# Altium schematic sheet Photodiode_AFE.schdoc: Photodiode & sensor
size 420 x 297 mm; EDA_Number: ARTIQ; Projet: KASLI 3U subsystem; CheckedBy: MK; Author: G.K.; CompanyName: CREOTECH; DrawnBy: G.K.; Organization: CTI SA; Address1: Creotech Instruments SA; Address2: Okulickiego 7/9, 05-500 Poland; DocumentNumber: 3; Revision: -; SheetNumber: 3; SheetTotal: 5; ModifiedBy: -; CreateDate: XX/XX/XXXX; CheckedDate: -; Title2: AFE; DivGrp: CTI; Designer: G.K.; ModifiedDate: -; ProjectName: FMC DAC 100M 14B 16CHA ADC 2M 14B 4CHA
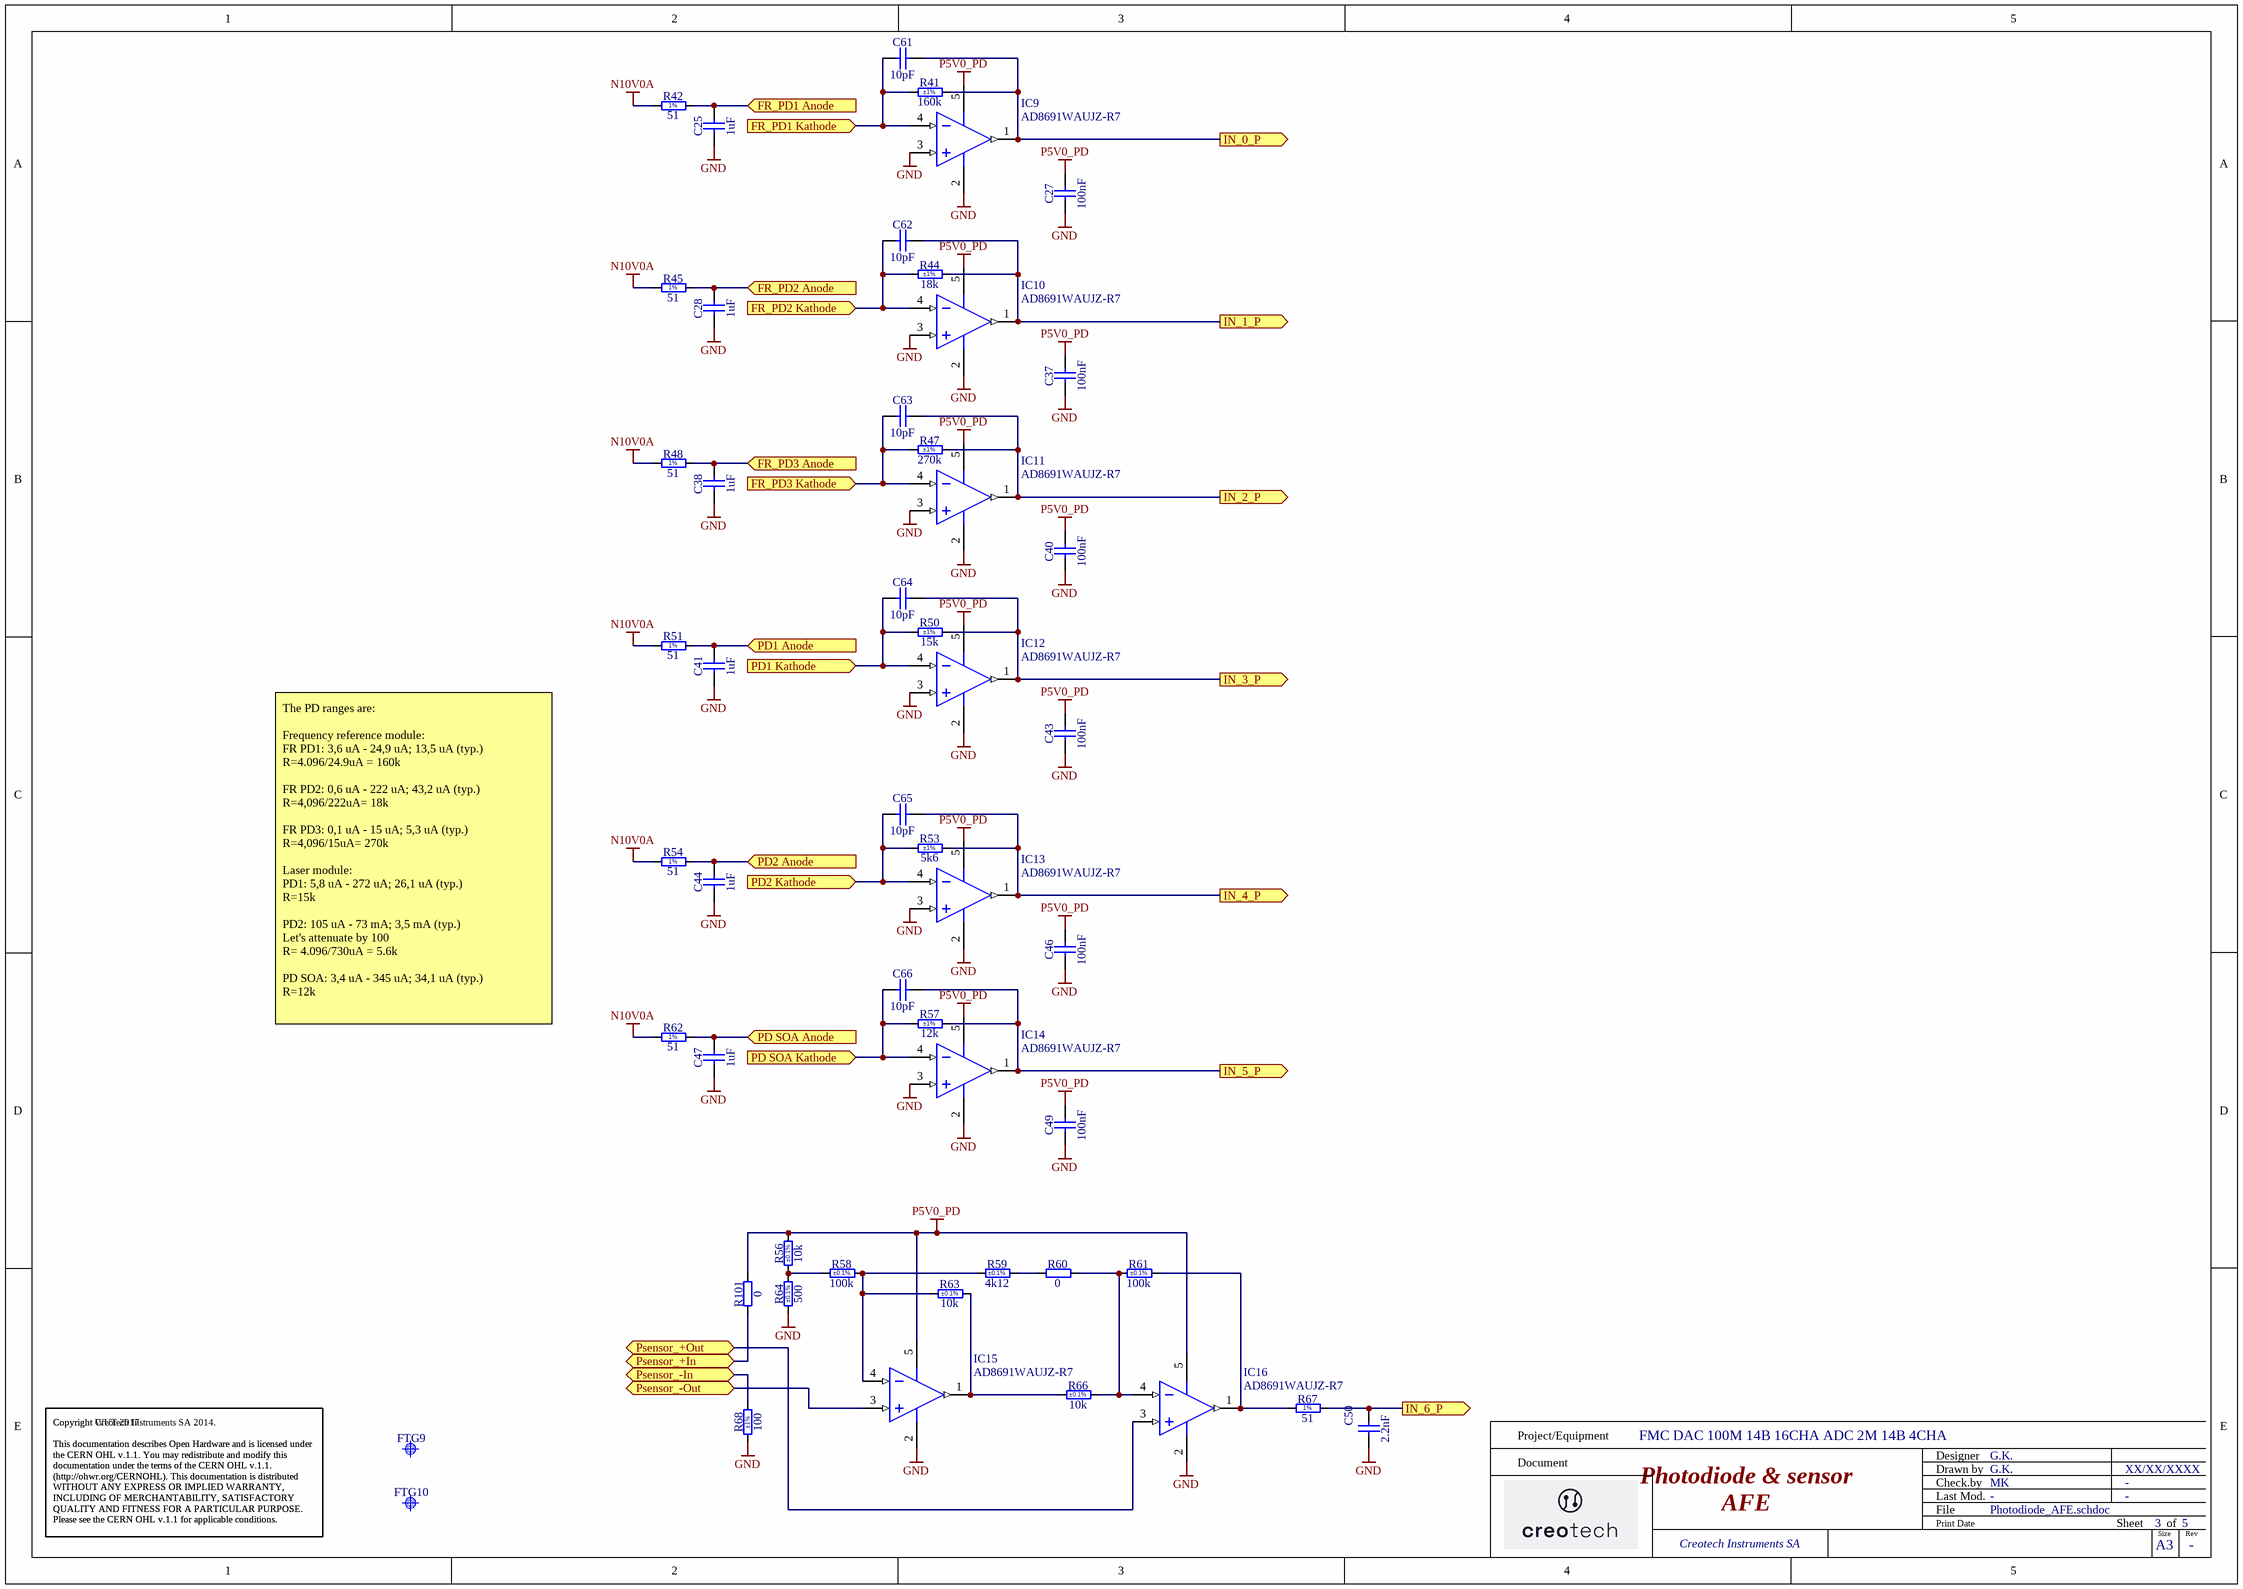
[diagram p0: Photodiode_AFE.schdoc]

## Parts
C25  1uF  [CAPC1005X55N]
C27  100nF  [CAPC1005X55N]
C28  1uF  [CAPC1005X55N]
C37  100nF  [CAPC1005X55N]
C38  1uF  [CAPC1005X55N]
C40  100nF  [CAPC1005X55N]
C41  1uF  [CAPC1005X55N]
C43  100nF  [CAPC1005X55N]
C44  1uF  [CAPC1005X55N]
C46  100nF  [CAPC1005X55N]
C47  1uF  [CAPC1005X55N]
C49  100nF  [CAPC1005X55N]
C50  2.2nF  [CAPC2013X100N]
C61  10pF  [CAPC1005X55N]
C62  10pF  [CAPC1005X55N]
C63  10pF  [CAPC1005X55N]
C64  10pF  [CAPC1005X55N]
C65  10pF  [CAPC1005X55N]
C66  10pF  [CAPC1005X55N]
FTG9  Use only in PCB  [FIDUCIAL_TOP_C100-200]  (value not drawn)
FTG10  Use only in PCB  [FIDUCIAL_TOP_S100-200]  (value not drawn)
IC9  AD8691WAUJZ-R7  [ADI-UJ-5_L]
IC10  AD8691WAUJZ-R7  [ADI-UJ-5_L]
IC11  AD8691WAUJZ-R7  [ADI-UJ-5_L]
IC12  AD8691WAUJZ-R7  [ADI-UJ-5_L]
IC13  AD8691WAUJZ-R7  [ADI-UJ-5_L]
IC14  AD8691WAUJZ-R7  [ADI-UJ-5_L]
IC15  AD8691WAUJZ-R7  [ADI-UJ-5_L]
IC16  AD8691WAUJZ-R7  [ADI-UJ-5_L]
R41  160k  Tolerance: ±1%  [RESC1608X55N]
R42  51  [RESC1005X40N]
R44  18k  Tolerance: ±1%  [RESC1608X55N]
R45  51  [RESC1005X40N]
R47  270k  Tolerance: ±1%  [RESC1608X55N]
R48  51  [RESC1005X40N]
R50  15k  Tolerance: ±1%  [RESC1608X55N]
R51  51  [RESC1005X40N]
R53  5k6  Tolerance: ±1%  [RESC1608X55N]
R54  51  [RESC1005X40N]
R56  10k  Tolerance: ±0.1%  [RESC1608X64N]
R57  12k  Tolerance: ±1%  [RESC1608X55N]
R58  100k  Tolerance: ±0.1%  [RESC1608X55N]
R59  4k12  Tolerance: ±0.1%  [RESC1608X55N]
R60  0  [RESC1608X55N]
R61  100k  Tolerance: ±0.1%  [RESC1608X55N]
R62  51  [RESC1005X40N]
R63  10k  Tolerance: ±0.1%  [RESC1608X64N]
R64  500  Tolerance: ±0.1%  [RESC1106X84N]
R66  10k  Tolerance: ±0.1%  [RESC1608X64N]
R67  51  [RESC1005X40N]
R68  100  Tolerance: ±1%  [RESC1005X40N]
R101  0  [RESC1608X55N]

## Ports
FR_PD1 Anode (in), FR_PD1 Kathode (in), FR_PD2 Anode (in), FR_PD2 Kathode (in), FR_PD3 Anode (in), FR_PD3 Kathode (in), IN_0_P (out), IN_1_P (out), IN_2_P (out), IN_3_P (out), IN_4_P (out), IN_5_P (out), IN_6_P (out), PD1 Anode (in), PD1 Kathode (in), PD2 Anode (in), PD2 Kathode (in), PD SOA Anode (in), PD SOA Kathode (in), Psensor_+In (bidir), Psensor_+Out (bidir), Psensor_-In (bidir), Psensor_-Out (bidir)

## Nets
GND: C25.1 C27.1 C28.1 C37.1 C38.1 C40.1 C41.1 C43.1 C44.1 C46.1 C47.1 C49.1 C50.1 IC9.2(-V) IC9.3(+IN) IC10.2(-V) IC10.3(+IN) IC11.2(-V) IC11.3(+IN) IC12.2(-V) IC12.3(+IN) IC13.2(-V) IC13.3(+IN) IC14.2(-V) IC14.3(+IN) IC15.2(-V) IC16.2(-V) R64.1 R68.1
N10V0A: R42.1 R45.1 R48.1 R51.1 R54.1 R62.1
P5V0_PD: C27.2 C37.2 C40.2 C43.2 C46.2 C49.2 IC9.5(+V) IC10.5(+V) IC11.5(+V) IC12.5(+V) IC13.5(+V) IC14.5(+V) IC15.5(+V) IC16.5(+V) R56.2 R101.2
FR_PD1 Anode: C25.2 R42.2 ; port FR_PD1 Anode
FR_PD1 Kathode: C61.1 IC9.4(-IN) R41.1 ; port FR_PD1 Kathode
FR_PD2 Anode: C28.2 R45.2 ; port FR_PD2 Anode
FR_PD2 Kathode: C62.1 IC10.4(-IN) R44.1 ; port FR_PD2 Kathode
FR_PD3 Anode: C38.2 R48.2 ; port FR_PD3 Anode
FR_PD3 Kathode: C63.1 IC11.4(-IN) R47.1 ; port FR_PD3 Kathode
IN_0_P: C61.2 IC9.1(OUT) R41.2 ; port IN_0_P
IN_1_P: C62.2 IC10.1(OUT) R44.2 ; port IN_1_P
IN_2_P: C63.2 IC11.1(OUT) R47.2 ; port IN_2_P
IN_3_P: C64.2 IC12.1(OUT) R50.2 ; port IN_3_P
IN_4_P: C65.2 IC13.1(OUT) R53.2 ; port IN_4_P
IN_5_P: C66.2 IC14.1(OUT) R57.2 ; port IN_5_P
IN_6_P: C50.2 R67.2 ; port IN_6_P
PD1 Anode: C41.2 R51.2 ; port PD1 Anode
PD1 Kathode: C64.1 IC12.4(-IN) R50.1 ; port PD1 Kathode
PD2 Anode: C44.2 R54.2 ; port PD2 Anode
PD2 Kathode: C65.1 IC13.4(-IN) R53.1 ; port PD2 Kathode
PD SOA Anode: C47.2 R62.2 ; port PD SOA Anode
PD SOA Kathode: C66.1 IC14.4(-IN) R57.1 ; port PD SOA Kathode
Psensor_+In: R101.1 ; port Psensor_+In
Psensor_+Out: IC16.3(+IN) ; port Psensor_+Out
Psensor_-In: R68.2 ; port Psensor_-In
Psensor_-Out: IC15.3(+IN) ; port Psensor_-Out
NetIC15_1: IC15.1(OUT) R63.2 R66.1
NetIC15_4: IC15.4(-IN) R58.2 R59.1 R63.1
NetIC16_1: IC16.1(OUT) R61.2 R67.1
NetIC16_4: IC16.4(-IN) R60.2 R61.1 R66.2
NetR56_1: R56.1 R58.1 R64.2
NetR59_2: R59.2 R60.1

## Notes on the sheet
- The PD ranges are:
  Frequency reference module:
  FR PD1: 3,6 uA - 24,9 uA; 13,5 uA (typ.)
  R=4.096/24.9uA = 160k
  FR PD2: 0,6 uA - 222 uA; 43,2 uA (typ.)
  R=4,096/222uA= 18k
  FR PD3: 0,1 uA - 15 uA; 5,3 uA (typ.)
  R=4,096/15uA= 270k
  Laser module:
  PD1: 5,8 uA - 272 uA; 26,1 uA (typ.)
  R=15k
  PD2: 105 uA - 73 mA; 3,5 mA (typ.)
  Let's attenuate by 100
  R= 4.096/730uA = 5.6k
  PD SOA: 3,4 uA - 345 uA; 34,1 uA (typ.)
  R=12k
- Copyright WUT 2017
  This documentation describes Open Hardware and is licensed under the CERN OHL v.1.1. You may redistribute and modify this documentation under the terms of the CERN OHL v.1.1. (http://ohwr.org/CERNOHL). This documentation is distributed WITHOUT ANY EXPRESS OR IMPLIED WARRANTY, INCLUDING OF MERCHANTABILITY, SATISFACTORY QUALITY AND FITNESS FOR A PARTICULAR PURPOSE. Please see the CERN OHL v.1.1 for applicable conditions.
- Project/Equipment
- Document
- Designer
- Drawn by
- Check.by
- Copyright Creotech Instruments SA 2014.
  This documentation describes Open Hardware and is licensed under the CERN OHL v.1.1. You may redistribute and modify this documentation under the terms of the CERN OHL v.1.1. (http://ohwr.org/CERNOHL). This documentation is distributed WITHOUT ANY EXPRESS OR IMPLIED WARRANTY, INCLUDING OF MERCHANTABILITY, SATISFACTORY QUALITY AND FITNESS FOR A PARTICULAR PURPOSE. Please see the CERN OHL v.1.1 for applicable conditions.
- File
- Last Mod.
- Print Date
- Sheet
- Size
- A3
- of
- Rev
- (in symbol R0402_51R_1%_0.0625W_100PPM) 1%

## Library data of the parts
C25 C28 C38 C41 C44 C47 = CC0402_1UF_16V_10%_X5R: Non-polarised capacitor; Part Description: SMD Multilayer Chip Ceramic Capacitor; Manufacturer: GENERIC; Manufacturer1 Part Number: C1005X5R1C105KT; Voltage: 16V; TC: X5R; Tolerance: ±10%; Part Number: CC0402_1UF_16V_10%_X5R; Component Kind: Standard; Component Type: Standard; Pin Count: 2; Value: 1uF; Status: Preferred; Manufacturer Part Number: CC0402_1UF_16V_10%_X5R; Case: 0402; Mounted: Yes; Socket: No; SMD: Yes; Sense: No; Manufacturer1 Example: TDK; Manufacturer1 ComponentHeight: 0.55mm; HelpURL: \\cern.ch\dfs\Applications\Altium\Datasheets\CC0402_X5R_TDK_C.pdf; Author: CERN DEM JLC; CreateDate: 25.10.2012; LatestRevisionDate: 25.10.2012
C27 C37 C40 C43 C46 C49 = CC0402_100NF_16V_10%_X5R: Non-polarised capacitor; Part Description: SMD Multilayer Chip Ceramic Capacitor; Manufacturer: GENERIC; Manufacturer1 Part Number: GRM155R61C104KA88D; Voltage: 16V; TC: X5R; Tolerance: ±10%; Part Number: CC0402_100NF_16V_10%_X5R; Component Kind: Standard; Component Type: Standard; Pin Count: 2; Value: 100nF; Status: None; Manufacturer Part Number: CC0402_100NF_16V_10%_X5R; Case: 0402; Mounted: Yes; Socket: No; SMD: Yes; Sense: No; Manufacturer1 Example: MURATA; Manufacturer1 ComponentHeight: 0.55mm; HelpURL: \\cern.ch\dfs\Applications\Altium\Datasheets\CC0402_X5R_MURATA_GRM.pdf; Author: CERN DEM JLC; CreateDate: 10.12.2013; LatestRevisionDate: 10.12.2013
C50 = CC0805_2.2NF_25V_1%_C0G: Non-polarised capacitor; Part Description: SMD Multilayer Chip Ceramic Capacitor; Manufacturer: GENERIC; Manufacturer1 Part Number: C0805C222F3GACTU; Voltage: 25V; TC: C0G/NP0; Tolerance: ±1%; Part Number: CC0805_2.2NF_25V_1%_C0G; Component Kind: Standard; Component Type: Standard; Pin Count: 2; Value: 2.2nF; Status: None; Manufacturer Part Number: CC0805_2.2NF_25V_1%_C0G; Case: 0805; Mounted: Yes; Socket: No; SMD: Yes; Sense: No; Manufacturer1 Example: KEMET; Manufacturer1 ComponentHeight: 0.88mm; HelpURL: \\cern.ch\dfs\Applications\Altium\Datasheets\CC0805_C0G_KEMET_(Commercial Grade).pdf; Author: CERN DEM JLC; CreateDate: 11.03.2015; LatestRevisionDate: 11.03.2015
C61-C66 = CC0402_10PF_50V_5%_C0G: Non-polarised capacitor; Part Description: SMD Multilayer Chip Ceramic Capacitor; Manufacturer: GENERIC; Manufacturer1 Part Number: C0402C100J5GACTU; Voltage: 50V; TC: C0G/NP0; Tolerance: ±5%; Part Number: CC0402_10PF_50V_5%_C0G; Component Kind: Standard; Component Type: Standard; Pin Count: 2; Value: 10pF; Status: Preferred; Manufacturer Part Number: CC0402_10PF_50V_5%_C0G; Case: 0402; Mounted: Yes; Socket: No; SMD: Yes; Sense: No; Manufacturer1 Example: KEMET; Manufacturer1 ComponentHeight: 0.55mm; HelpURL: \\cern.ch\dfs\Applications\Altium\Datasheets\CC0402_C0G_KEMET_(Commercial Grade).pdf; Author: CERN DEM JLC; CreateDate: 03.12.2007; LatestRevisionDate: 22.04.2015
FTG9 = FIDUCIAL_TARGET_C100-200: Fiducial Target; Part Description: Round Fiducial Target, Top Layer, 1.0mm, Top Solder 2.0mm, Keepout =2.0mm; Mounted: No; Part Number: FIDUCIAL_TARGET_C100-200; Component Kind: Standard (No BOM); Component Type: Standard (No BOM); Pin Count: 1; Family: Fiducial; Socket: No; SMD: Yes; Sense: No; Status: None; ComponentHeight: 0mm; HelpURL: Undefined; Author: CERN DEM JLC; CreateDate: 09.02.2010; LatestRevisionDate: 04.04.2012; PackageDescription: Round Fiducial Target, Top Layer, 1.0mm, Top Solder 2.0mm, Keepout =2.0mm
FTG10 = FIDUCIAL_TARGET_S100-200: Fiducial Target; Part Description: Square Fiducial Target, Top Layer, 1.0mm, Top Solder 2.0mm, Keepout =2.0mm; Mounted: No; Part Number: FIDUCIAL_TARGET_S100-200; Component Kind: Standard (No BOM); Component Type: Standard (No BOM); Pin Count: 1; Family: Fiducial; Socket: No; SMD: Yes; Sense: No; Status: None; ComponentHeight: 0mm; HelpURL: Undefined; Author: CERN DEM JLC; CreateDate: 09.02.2010; LatestRevisionDate: 04.04.2012; PackageDescription: Square Fiducial Target, Top Layer, 1.0mm, Top Solder 2.0mm, Keepout =2.0mm
IC9-IC16 = CMP-0384-02080-1: Single Channel Wide Bandwidth Operational Amplifier, 10 MHz BW, 5 V/us SR, Automotive, 5-pin SOT23 (UJ-5), Reel; Manufacturer: Analog Devices; Generic Part Number: AD8691; Small Signal Bandwidth: 10MHz; Input Offset Voltage: 400uV; V Span Max: 6V; Automotive Qualified: Yes; Slew Rate: 5V/us; Iq/Amp: 1.05mA; Amplifiers Per Package: 1; Input Bias Current: 200fA; V Span Min: 2.7V; ComponentLink2URL: http://www.analog.com/static/imported-files/data_sheets/AD8691_8692_8694.pdf; ComponentLink3Description: Package Specification; ComponentLink1Description: Manufacturer URL; ComponentLink1URL: http://www.analog.com/en/index.html; PackageReference: UJ-5; DatasheetVersion: Rev. E; PartNumber: AD8691WAUJZ-R7; PackageVersion: 100708-A; PackageDescription: 5-Pin Thin Small Outline Transistor Package, Body 2.9 x 1.6 mm, Pitch 0.95 mm; Code_JEDEC: MO-193-AB; Mounting Technology: Surface Mount; ComponentLink3URL: http:/www.analog.com/static/imported-files/packages/PKG_PDF/TSOT(UJ)/UJ_5.pdf; ComponentLink2Description: Datasheet
R41 = R0603_160K_1%_0.1W_100PPM: Resistor - 1%; Part Description: General Purpose Thick Film Chip Resistor; Manufacturer: GENERIC; Manufacturer1 Part Number: NRC06F1603TRF; Power: 0.1W; TC: ±100ppm/°C; PressFit: No; Part Number: R0603_160K_1%_0.1W_100PPM; Component Kind: Standard; Component Type: Standard; Pin Count: 2; Value: 160k; Status: Preferred; Manufacturer Part Number: R0603_160K_1%_0.1W_100PPM; Case: 0603; Mounted: Yes; Sense: No; Socket: No; SMD: Yes; Manufacturer1 Example: NIC COMPONENT; Manufacturer1 ComponentHeight: 0.55mm; HelpURL: \\cern.ch\dfs\Applications\Altium\Datasheets\R0603_NIC_NRC.pdf; Author: CERN DEM JLC; CreateDate: 03.12.2007; LatestRevisionDate: 13.03.2008
R42 R45 R48 R51 R54 R62 R67 = R0402_51R_1%_0.0625W_100PPM: Resistor - 1%; Part Description: General Purpose Thick Film Chip Resistor; Manufacturer: GENERIC; Manufacturer1 Part Number: 232270675109L; TC: ±100ppm/°C; PressFit: No; Part Number: R0402_51R_1%_0.0625W_100PPM; Component Kind: Standard; Component Type: Standard; Pin Count: 2; Value: 51; Status: Not Recommended; Power: 0.0625W; Tolerance: ±1%; Manufacturer Part Number: R0402_51R_1%_0.0625W_100PPM; Case: 0402; Mounted: Yes; Sense: No; Socket: No; SMD: Yes; Manufacturer1 Example: YAGEO PHYCOMP; Manufacturer1 ComponentHeight: 0.4mm; HelpURL: \\cern.ch\dfs\Applications\Altium\Datasheets\R0402_Phycomp_RC0402.pdf; Author: CERN DEM JLC; CreateDate: 03.12.2007; LatestRevisionDate: 17.10.2012
R44 = R0603_18K_1%_0.1W_100PPM: Resistor - 1%; Part Description: General Purpose Thick Film Chip Resistor; Manufacturer: GENERIC; Manufacturer1 Part Number: NRC06F1802TRF; Power: 0.1W; TC: ±100ppm/°C; PressFit: No; Part Number: R0603_18K_1%_0.1W_100PPM; Component Kind: Standard; Component Type: Standard; Pin Count: 2; Value: 18k; Status: Preferred; Manufacturer Part Number: R0603_18K_1%_0.1W_100PPM; Case: 0603; Mounted: Yes; Sense: No; Socket: No; SMD: Yes; Manufacturer1 Example: NIC COMPONENT; Manufacturer1 ComponentHeight: 0.55mm; HelpURL: \\cern.ch\dfs\Applications\Altium\Datasheets\R0603_NIC_NRC.pdf; Author: CERN DEM JLC; CreateDate: 03.12.2007; LatestRevisionDate: 13.03.2008
R47 = R0603_270K_1%_0.1W_100PPM: Resistor - 1%; Part Description: General Purpose Thick Film Chip Resistor; Manufacturer: GENERIC; Manufacturer1 Part Number: NRC06F2703TRF; Power: 0.1W; TC: ±100ppm/°C; PressFit: No; Part Number: R0603_270K_1%_0.1W_100PPM; Component Kind: Standard; Component Type: Standard; Pin Count: 2; Value: 270k; Status: Preferred; Manufacturer Part Number: R0603_270K_1%_0.1W_100PPM; Case: 0603; Mounted: Yes; Sense: No; Socket: No; SMD: Yes; Manufacturer1 Example: NIC COMPONENT; Manufacturer1 ComponentHeight: 0.55mm; HelpURL: \\cern.ch\dfs\Applications\Altium\Datasheets\R0603_NIC_NRC.pdf; Author: CERN DEM JLC; CreateDate: 03.12.2007; LatestRevisionDate: 13.03.2008
R50 = R0603_15K_1%_0.1W_100PPM: Resistor - 1%; Part Description: General Purpose Thick Film Chip Resistor; Manufacturer: GENERIC; Manufacturer1 Part Number: NRC06F1502TRF; Power: 0.1W; TC: ±100ppm/°C; PressFit: No; Part Number: R0603_15K_1%_0.1W_100PPM; Component Kind: Standard; Component Type: Standard; Pin Count: 2; Value: 15k; Status: Preferred; Manufacturer Part Number: R0603_15K_1%_0.1W_100PPM; Case: 0603; Mounted: Yes; Sense: No; Socket: No; SMD: Yes; Manufacturer1 Example: NIC COMPONENT; Manufacturer1 ComponentHeight: 0.55mm; HelpURL: \\cern.ch\dfs\Applications\Altium\Datasheets\R0603_NIC_NRC.pdf; Author: CERN DEM JMW; CreateDate: 17.08.2015; LatestRevisionDate: 17.08.2015
R53 = R0603_5K6_1%_0.125W_100PPM: Resistor - 1%; Part Description: Surge Current Thick Film Chip Resistor; Manufacturer: GENERIC; Manufacturer1 Part Number: SG73S1JTTD5601F; Power: 0.125W; TC: ±100ppm/°C; PressFit: No; Part Number: R0603_5K6_1%_0.125W_100PPM; Component Kind: Standard; Component Type: Standard; Pin Count: 2; Value: 5k6; Status: Not Recommended; Manufacturer Part Number: R0603_5K6_1%_0.125W_100PPM; Case: 0603; Mounted: Yes; Sense: No; Socket: No; SMD: Yes; Manufacturer1 Example: KOA; Manufacturer1 ComponentHeight: 0.55mm; HelpURL: \\cern.ch\dfs\Applications\Altium\Datasheets\R0603_KOA_SG73.pdf; Author: CERN DEM WB; CreateDate: 25.07.2016; LatestRevisionDate: 25.07.2016
R56 R63 R66 = R0603_10K_0.1%_0.1W_25PPM: Resistor - 0.1%; Part Description: Thin Film Chip Resistor; Manufacturer: GENERIC; Manufacturer1 Part Number: ERA3AEB103V; Power: 0.1W; TC: ±25ppm/°C; PressFit: No; Part Number: R0603_10K_0.1%_0.1W_25PPM; Component Kind: Standard; Component Type: Standard; Pin Count: 2; Value: 10k; Status: Not Recommended; Manufacturer Part Number: R0603_10K_0.1%_0.1W_25PPM; Case: 0603; Mounted: Yes; Sense: No; Socket: No; SMD: Yes; Manufacturer1 Example: PANASONIC; Manufacturer1 ComponentHeight: 0.55mm; HelpURL: \\cern.ch\dfs\Applications\Altium\Datasheets\R0603_PANASONIC_ERA.pdf; Author: CERN DEM JMW; CreateDate: 09.11.2015; LatestRevisionDate: 11.01.2017
R57 = R0603_12K_1%_0.1W_100PPM: Resistor - 1%; Part Description: General Purpose Thick Film Chip Resistor; Manufacturer: GENERIC; Manufacturer1 Part Number: NRC06F1202TRF; Power: 0.1W; TC: ±100ppm/°C; PressFit: No; Part Number: R0603_12K_1%_0.1W_100PPM; Component Kind: Standard; Component Type: Standard; Pin Count: 2; Value: 12k; Status: Preferred; Manufacturer Part Number: R0603_12K_1%_0.1W_100PPM; Case: 0603; Mounted: Yes; Sense: No; Socket: No; SMD: Yes; Manufacturer1 Example: NIC COMPONENT; Manufacturer1 ComponentHeight: 0.55mm; HelpURL: \\cern.ch\dfs\Applications\Altium\Datasheets\R0603_NIC_NRC.pdf; Author: CERN DEM JLC; CreateDate: 03.12.2007; LatestRevisionDate: 13.03.2008
R58 R61 = R0603_100K_0.1%_0.063W_10PPM: Resistor - 0.1%; Part Description: Thin Film Chip Resistor; Manufacturer: GENERIC; Manufacturer1 Part Number: RN73C1J100KBTDF; Power: 0.063W; TC: ±10ppm; PressFit: No; Part Number: R0603_100K_0.1%_0.063W_10PPM; Component Kind: Standard; Component Type: Standard; Pin Count: 2; Value: 100k; Status: Not Recommended; Manufacturer Part Number: R0603_100K_0.1%_0.063W_10PPM; Case: 0603; Mounted: Yes; Sense: No; Socket: No; SMD: Yes; Manufacturer1 Example: TYCO HOLSWORTHY; Manufacturer1 ComponentHeight: 0.55mm; HelpURL: \\cern.ch\dfs\Applications\Altium\Datasheets\R0603_Tyco_RN73.pdf; Author: CERN DEM JLC; CreateDate: 03.12.2007; LatestRevisionDate: 13.03.2008
R59 = R0603_4K12_0.1%_0.063W_10PPM: Resistor - 0.1%; Part Description: Thin Film Chip Resistor; Manufacturer: GENERIC; Manufacturer1 Part Number: RN73C1J4K12BTDF; Power: 0.063W; TC: ±10ppm; PressFit: No; Part Number: R0603_4K12_0.1%_0.063W_10PPM; Component Kind: Standard; Component Type: Standard; Pin Count: 2; Value: 4k12; Status: Not Recommended; Manufacturer Part Number: R0603_4K12_0.1%_0.063W_10PPM; Case: 0603; Mounted: Yes; Sense: No; Socket: No; SMD: Yes; Manufacturer1 Example: TYCO HOLSWORTHY; Manufacturer1 ComponentHeight: 0.5mm; HelpURL: \\cern.ch\dfs\Applications\Altium\Datasheets\R0603_Tyco_RN73.pdf; Author: CERN DEM JLC; CreateDate: 03.12.2007; LatestRevisionDate: 13.03.2008
R60 R101 = R0603_0R_JUMPER: Resistor; Part Description: 1A (0.05R Max DC Resistance) Zero Ohm Jumper; Manufacturer: GENERIC; Manufacturer1 Part Number: NRC06Z0; PressFit: No; Part Number: R0603_0R_JUMPER; Component Kind: Standard; Component Type: Standard; Pin Count: 2; Value: 0; Status: Preferred; Manufacturer Part Number: R0603_0R_JUMPER; Case: 0603; Mounted: Yes; Sense: No; Socket: No; SMD: Yes; Manufacturer1 Example: NIC COMPONENT; Manufacturer1 ComponentHeight: 0.55mm; HelpURL: \\cern.ch\dfs\Applications\Altium\Datasheets\R0603_NIC_NRC.pdf; Author: CERN DEM JLC; CreateDate: 03.12.2007; LatestRevisionDate: 13.03.2008
R64 = R0402_500R_0.1%_0.05W_25PPM_VISHAY_PNM: Resistor - 0.1%; Part Description: Surface Mount Precision Thin Film Non-Magnetic Resistor; Manufacturer: VISHAY; Manufacturer Part Number: PNM0402E5000BST1; Power: 0.05W; TC: ±25ppm/°C; PressFit: No; Part Number: R0402_500R_0.1%_0.05W_25PPM_VISHAY_PNM; Component Kind: Standard; Component Type: Standard; Pin Count: 2; Value: 500; Status: None; Case: 0402; Mounted: Yes; Sense: No; Socket: No; SMD: Yes; ComponentHeight: 0.84mm; HelpURL: \\cern.ch\dfs\Applications\Altium\Datasheets\R0402_VISHAY_PNM.pdf; Author: CERN DEM JLC; CreateDate: 22.08.2018; LatestRevisionDate: 22.08.2018
R68 = R0402_100R_1%_0.0625W_100PPM: Resistor - 1%; Part Description: General Purpose Thick Film Chip Resistor; Manufacturer: GENERIC; Manufacturer1 Part Number: 232270671001L; TC: ±100ppm/°C; PressFit: No; Part Number: R0402_100R_1%_0.0625W_100PPM; Component Kind: Standard; Component Type: Standard; Pin Count: 2; Value: 100; Status: Not Recommended; Power: 0.0625W; Manufacturer Part Number: R0402_100R_1%_0.0625W_100PPM; Case: 0402; Mounted: Yes; Sense: No; Socket: No; SMD: Yes; Manufacturer1 Example: YAGEO PHYCOMP; Manufacturer1 ComponentHeight: 0.4mm; HelpURL: \\cern.ch\dfs\Applications\Altium\Datasheets\R0402_Phycomp_RC0402.pdf; Author: CERN DEM JLC; CreateDate: 03.12.2007; LatestRevisionDate: 17.10.2012